# EAGLE design FilamentBox (EAGLE 7.4.0)
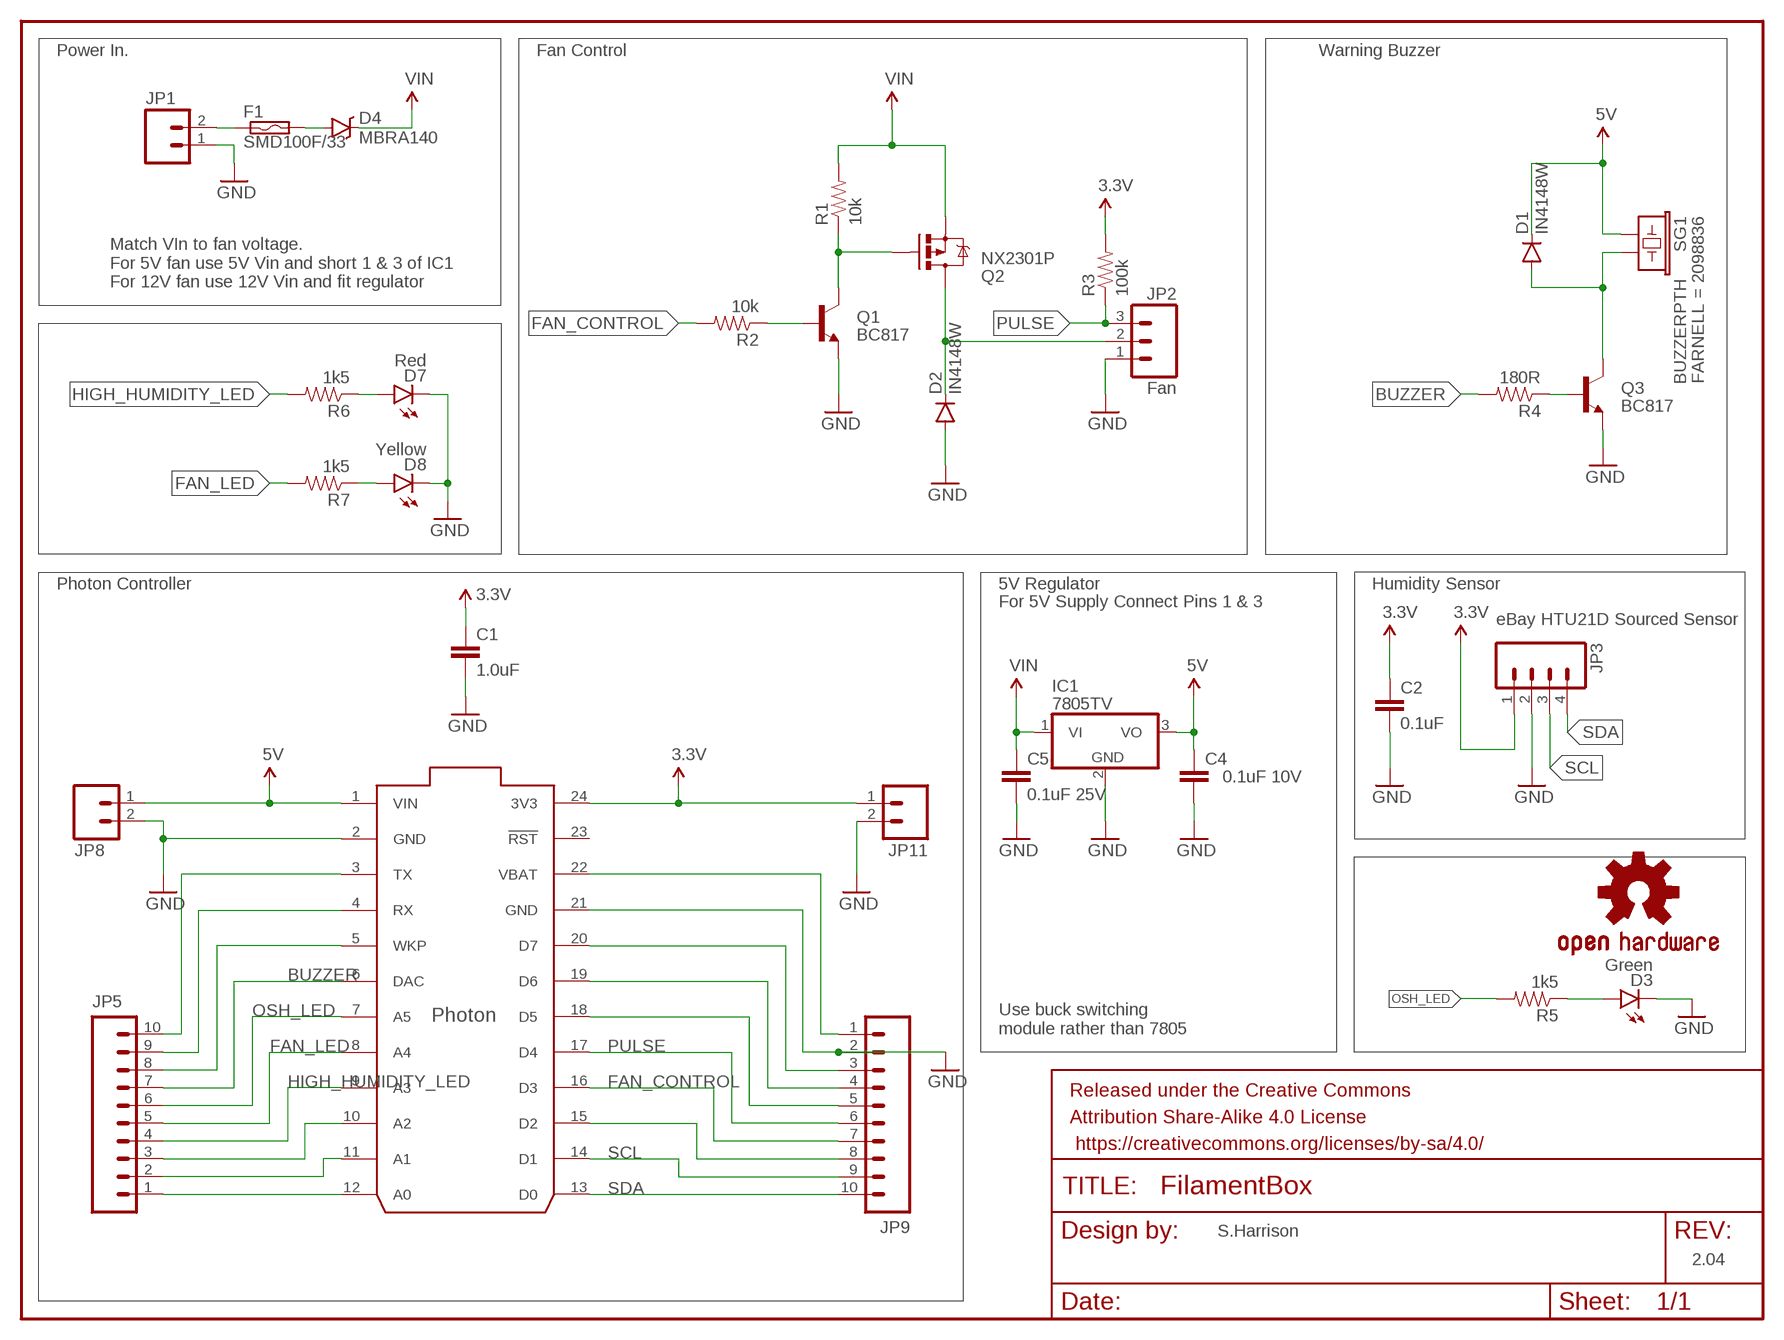
[diagram p0: schematic, sheet 1]

## Parts
C1  1.0uF  1.0UF-25V-+80/-20(0805)"  [0805-CAP]
C2  0.1uF  1.0UF-25V-+80/-20(0805)"  [0805-CAP]
C4  0.1uF 10V  1UF-25V-10%(0805)"  [0805-CAP]
C5  0.1uF 25V  1UF-25V-10%(0805)"  [0805-CAP]
D1  IN4148W  DIODESOD123  [SOD-123]
D2  IN4148W  DIODESOD123  [SOD-123]
D3  Green  LED1206-BOTTOM  [LED-1206-BOTTOM]
D4  MBRA140  DIODE-SCHOTTKY-MBRA140  [SMA-DIODE]
D7  Red  LED1206-BOTTOM  [LED-1206-BOTTOM]
D8  Yellow  LED1206-BOTTOM  [LED-1206-BOTTOM]
F1  SMD100F/33  [SMD050F]
FRAME1  FRAME-LETTER  [CREATIVE_COMMONS]
IC1  7805TV  [TO220V]
JP1  M02POLAR  [MOLEX-1X2]
JP2  Fan  M03POLAR  [MOLEX-1X3]
JP3  M04PTH  [1X04]
JP5  M10NO_SILK_PTH_FEMALE  [1X10_NO_SILK]
JP8  M021X02_NO_SILK  [1X02_NO_SILK]
JP9  M10NO_SILK_PTH_FEMALE  [1X10_NO_SILK]
JP11  M021X02_NO_SILK  [1X02_NO_SILK]
LOGO1  OSHW-LOGOL  [OSHW-LOGO-L]
Q1  BC817  BC817-40SMD  [SOT23-BEC]
Q2  NX2301P  MOSFET-PCHANNEL  [SOT23-3]
Q3  BC817  BC817-40SMD  [SOT23-BEC]
R1  10k  RESISTOR0805-RES  [0805]
R2  10k  RESISTOR0805-RES  [0805]
R3  100k  RESISTOR0805-RES  [0805]
R4  180R  RESISTOR0805-RES  [0805]
R5  1k5  RESISTOR0805-RES  [0805]
R6  1k5  RESISTOR0805-RES  [0805]
R7  1k5  RESISTOR0805-RES  [0805]
SG1  BUZZERPTH  [BUZZER-12MM]
U3  PHOTON  PHOTON_WITH_HEADERS  [PHOTON]

## Nets
3.3V: C1.1 C2.1 JP3.1 JP11.1 R3.2 U3.24(3V3)
5V: C4.1 D1.C IC1.3(VO) JP8.1 SG1.+ U3.1(VIN)
BUZZER: JP5.7 R4.2 U3.6(DAC)
FAN_CONTROL: JP9.7 R2.2 U3.16(D3)
FAN_LED: JP5.5 R7.2 U3.8(A4)
GND: C1.2 C2.2 C4.2 C5.2 D2.A D3.C D7.C D8.C IC1.2(GND) JP1.1 JP2.1 JP3.2 JP8.2 JP9.2 JP11.2 Q1.E Q3.E U3.2(GND) U3.21(GND)
HIGH_HUMIDITY_LED: JP5.4 R6.2 U3.9(A3)
N$1: JP5.1 U3.12(A0)
N$2: Q1.C Q2.1(G) R1.1
N$3: JP5.2 U3.11(A1)
N$4: Q1.B R2.1
N$5: JP5.3 U3.10(A2)
N$6: D2.C JP2.2 Q2.3(D)
N$10: JP9.8 U3.15(D2)
N$11: JP5.8 U3.5(WKP)
N$12: JP5.9 U3.4(RX)
N$13: JP5.10 U3.3(TX)
N$14: Q3.B R4.1
N$15: D1.A Q3.C SG1.-
N$16: JP9.3 U3.20(D7)
N$17: JP9.1 U3.22(VBAT)
N$18: D3.A R5.1
N$19: F1.1 JP1.2
N$20: D4.A F1.2
N$21: JP9.4 U3.19(D6)
N$22: JP9.5 U3.18(D5)
N$25: D7.A R6.1
N$26: D8.A R7.1
OSH_LED: JP5.6 R5.2 U3.7(A5)
PULSE: JP2.3 JP9.6 R3.1 U3.17(D4)
SCL: JP3.3 JP9.9 U3.14(D1)
SDA: JP3.4 JP9.10 U3.13(D0)
VIN: C5.1 D4.C IC1.1(VI) Q2.2(S) R1.2
Unconnected: U3.23(!RST)

## Notes on the sheet
- Power In. | Fan Control | Warning Buzzer
- Match VIn to fan voltage.
  For 5V fan use 5V Vin and short 1 & 3 of IC1
  For 12V fan use 12V Vin and fit regulator
- Photon Controller | 5V Regulator | Humidity Sensor
- For 5V Supply Connect Pins 1 & 3
- eBay HTU21D Sourced Sensor
- Use buck switching
  module rather than 7805
- S.Harrison
- 2.04

## Library data of the parts
C1 = SparkFun-Capacitors:1.0UF-25V-+80/-20(0805): CAP-11625; PROD_ID: CAP-11625
C2 = SparkFun-Capacitors:1.0UF-25V-+80/-20(0805): CAP-11625; PROD_ID: CAP-11625; VALUE: 1.0uF
C4 C5 = SparkFun-Capacitors:1UF-25V-10%(0805): CAP-08064
D1 D2 = SparkFun-DiscreteSemi:DIODE: Diode These are standard reverse protection diodes and small signal diodes. SMA package can handle up to about 1A. SOD-323 can handle about 200mA. What the SOD-323 package when ordering, there are some mfgs out there that are 5-pin packages.
D3 D7 D8 = SparkFun-LED:LED: LEDs Standard schematic elements and footprints for 5mm, 3mm, 1206, and 0603 sized LEDs. 5mm - Spark Fun Electronics SKU : COM-00529 (and others)
D4 = SparkFun-DiscreteSemi:DIODE-SCHOTTKY: Schottky diodes in SFE's production catalog BAT20J 1A 23V 0.62Vf RB751 120mA 40V 0.37Vf PMEG4005EJ 0.5A 40V 0.42Vf MBRA140 1A 40V 0.5Vf B340A 3A 40V SMA; PROD_ID: DIO-08053
F1 = switch-raychem:SMD*F: PolySwitch (TM) Resettable Device Source: Data sheet <http://www.farnell.com/datasheets/13482.pdf>; FARNELL: 1822224; MFG: LITTLEFUSE; MFGPART: 2920L075DR
FRAME1 = SparkFun-Aesthetics:FRAME-LETTER: Schematic Frame Standard 8.5x11 US Letter frame
IC1 = linear:78*: Positive VOLTAGE REGULATOR Source: http://cache.national.com/ds/LM/LM78L05.pdf http://www.fairchildsemi.com/ds/LM/LM7805.pdf
JP1 JP8 JP11 = SparkFun-Connectors:M02: Standard 2-pin 0.1" header. Use with - straight break away headers ( PRT-00116) - right angle break away headers (PRT-00553) - swiss pins (PRT-00743) - machine pins (PRT-00117) - female headers (PRT-00115) Molex polarized connector foot print use with: PRT-08233 with associated crimp pins and housings. 2.54_SCREWTERM for use with PRT-10571. 3.5mm Screw Terminal footprints for PRT-08084 5mm Screw Terminal footprints for use with PRT-08432
JP2 = SparkFun-Connectors:M03: Header 3 Standard 3-pin 0.1" header. Use with straight break away headers (SKU : PRT-00116), right angle break away headers (PRT-00553), swiss pins (PRT-00743), machine pins (PRT-00117), and female headers (PRT-00115). Molex polarized connector foot print use with SKU : PRT-08232 with associated crimp pins and housings.
JP3 = SparkFun-Connectors:M04: Header 4 Standard 4-pin 0.1" header. Use with straight break away headers (SKU : PRT-00116), right angle break away headers (PRT-00553), swiss pins (PRT-00743), machine pins (PRT-00117), and female headers (PRT-00115). Molex polarized connector foot print use with SKU : PRT-08231 with associated crimp pins and housings. 1MM SMD Version SKU: PRT-10208
JP5 JP9 = SparkFun-Connectors:M10: Header 10 Standard 10-pin 0.1" header. Use with straight break away headers (SKU : PRT-00116), right angle break away headers (PRT-00553), swiss pins (PRT-00743), machine pins (PRT-00117), and female headers (PRT-00115).; PROD_ID: CONN-11563
LOGO1 = Spark:OSHW-LOGO: Open Source Hardware Logo This logo indicates the piece of hardware it is found on incorporates a OSHW license and/or adheres to the definition of open source hardware found here: http://freedomdefined.org/OSHW
Q1 Q3 = transistor-npn:BC817*: NPN Transistor
Q2 = SparkFun-DiscreteSemi:MOSFET-PCHANNEL: Generic PMOSFET IRLML2244 - TRANS-11153 (SOT-23 -20V -4.3A) (1.Gate 2.Source 3.Drain) FQP27P06 - COM-10349 <http://www.sparkfun.com/products/10349> (TO-220 -60V -27A) (1.Gate 2.Source 3.Drain); PROD_ID: TRANS-08285
R1-R7 = SparkFun-Resistors:RESISTOR: Resistor Basic schematic elements and footprints for 0603, 1206, and PTH resistors.
SG1 = SparkFun-Electromechanical:BUZZER: Buzzer 12mm Spark Fun Electronics SKU : Comp-Buzzer; FARNELL: 2098836
U3 = Spark:PHOTON

## Board
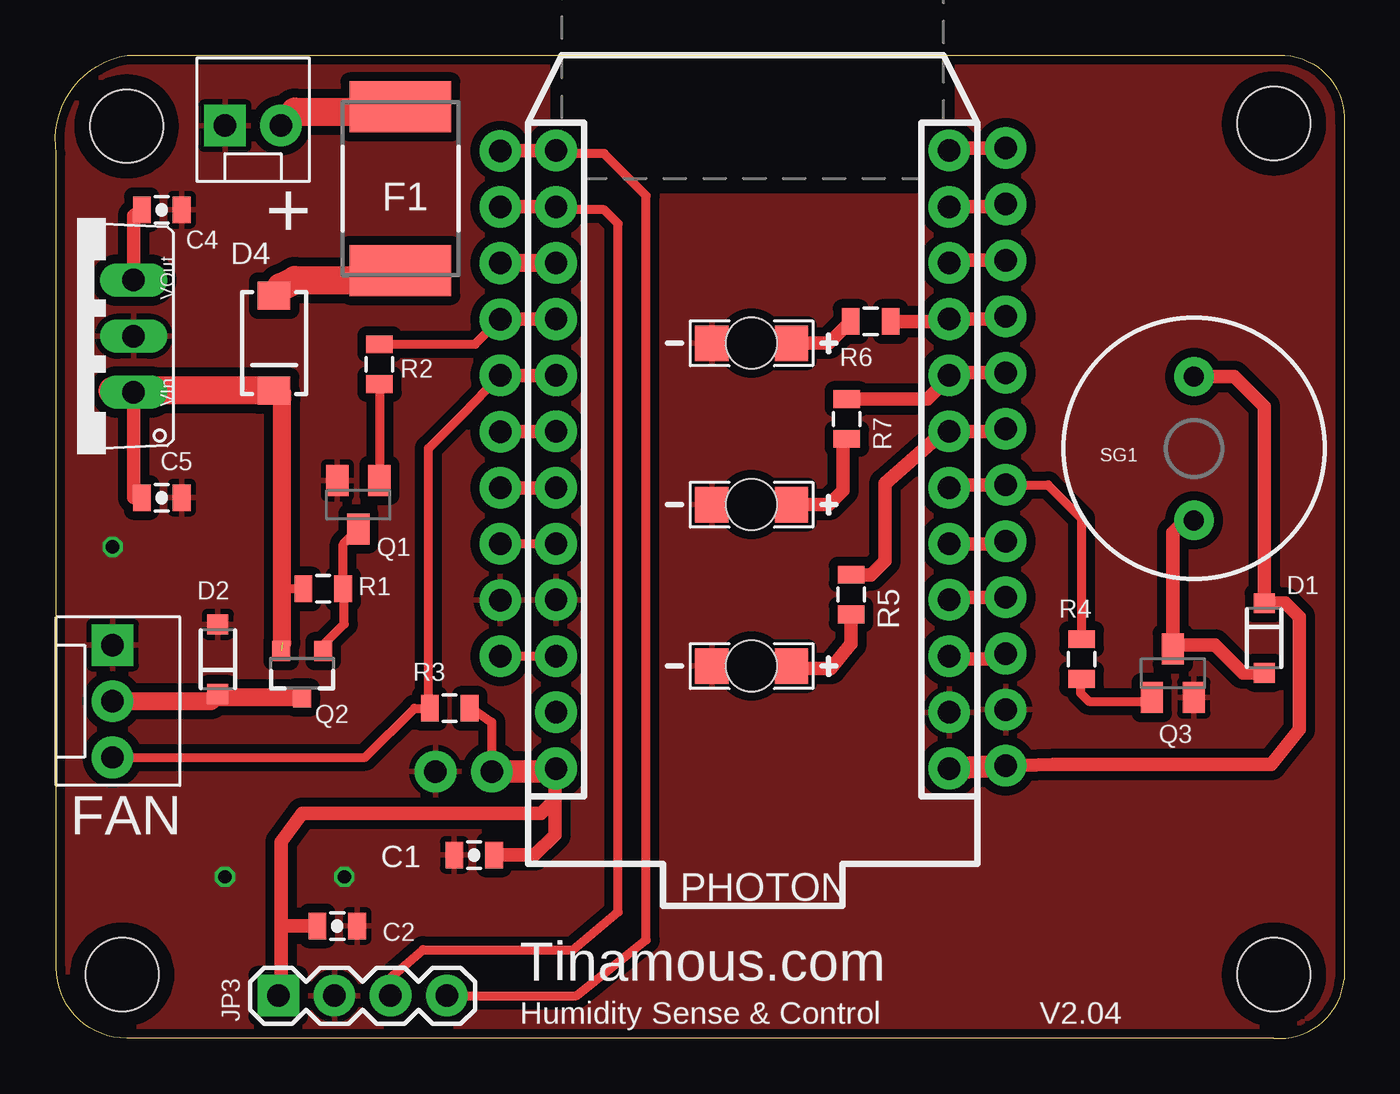
[diagram p1: board, top side]
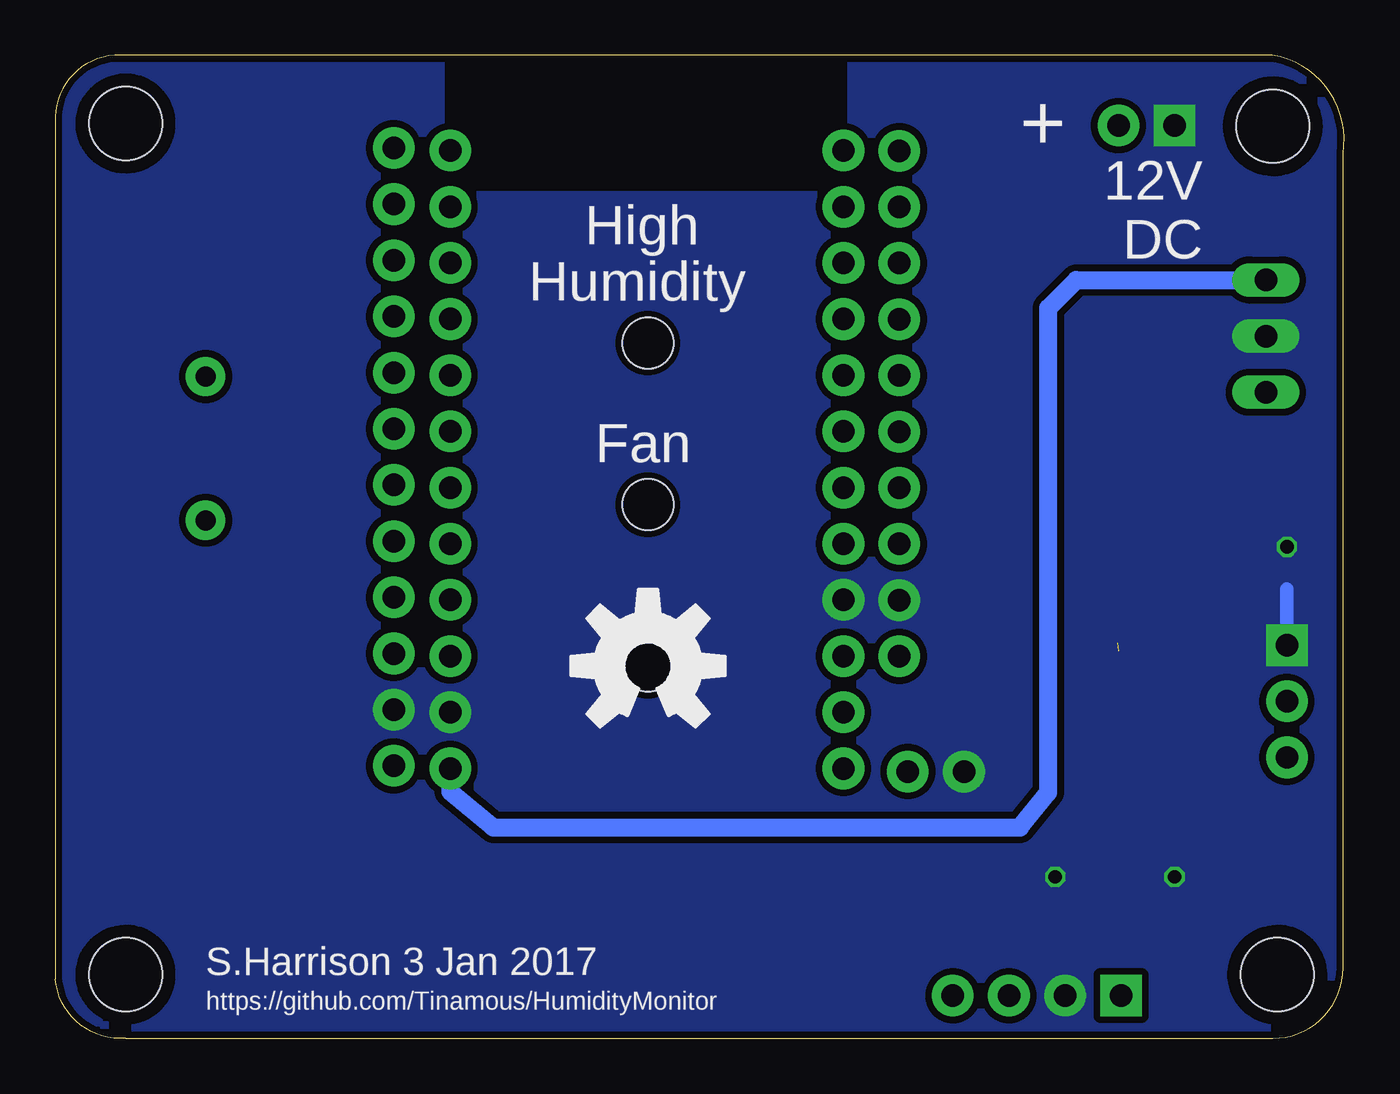
[diagram p2: board, bottom side, seen from below]

Size 58.28 x 44.46 mm. Coordinates in mm from the lower left corner, seen from the top.
Outline: 0.05,3.19 arc90 3.23,0.01 55.1,0.01 arc90 58.28,2.69 58.28,41.42 arc90 55.6,44.46 3.24,44.46 arc90 0.05,40.02 0.05,3.19
Outline: 0.05,3.12 0.05,3.19
Copper layers (1*16): Top 0.035mm / dielectric 1.5mm / Bottom 0.035mm
Design rules "dirt_cheap_dirty_boards.v1": minimum track width 5mil, minimum drill 12mil, track to track 5mil, track to pad 5mil, pad to pad 5mil, via to via 5mil, smd to smd 0mil, copper to edge 10mil, drill to drill 10mil, minimum pad ring 10mil, minimum via ring 6mil, stop-mask expansion 2mil, vias tented up to drill 25mil, thermal gap 10mil
tRestrict: area 22.9,38.7 to 40.1,48
bRestrict: area 22.9,38.7 to 40.2,48

### Footprints (pad centres in the part's own frame; a part is rotated, then mirrored left to right if it is on the bottom)
0805-CAP = smd 0.8 x 1.2: 1 -0.9,0; 2 0.9,0
SOD-123 = smd 0.9 x 0.95: A 1.575,0; C -1.575,0
LED-1206-BOTTOM = smd 1.5 x 1.6: A -1.8,0; C 1.8,0 | hole 2.3: 0,0
SMA-DIODE = smd 1.27 x 1.47: A -2.15,0; C 2.15,0
SMD050F = smd 2.3 x 4.6: 1 -3.7,0; 2 3.7,0
TO220V = drill 1.016 long: 1 -2.54,-2.54; 2 0,-2.54; 3 2.54,-2.54
MOLEX-1X2 = drill 1.016 pad 1.88 square: 1 0,0 | drill 1.016 pad 1.88: 2 2.54,0
MOLEX-1X3 = drill 1.016 pad 1.88 square: 1 0,0 | drill 1.016 pad 1.88: 2 2.54,0; 3 5.08,0
1X04 = drill 1.016 pad 1.88 square: 1 0,0 | drill 1.016 pad 1.88: 2 2.54,0; 3 5.08,0; 4 7.62,0
1X10_NO_SILK = drill 1.016 pad 1.88: 1 0,0; 2 2.54,0; 3 5.08,0; 4 7.62,0; 5 10.16,0; 6 12.7,0; 7 15.24,0; 8 17.78,0; 9 20.32,0; 10 22.86,0
1X02_NO_SILK = drill 1.016 pad 1.88: 1 0,0; 2 2.54,0
SOT23-BEC = smd 1 x 1.4: B -0.95,-1.1; C 0,1.1; E 0.95,-1.1
SOT23-3 = smd 0.8 x 0.9: 1 -0.95,-1; 2 0.95,-1; 3 0,1.1
0805 = smd 0.8 x 1.2: 1 -0.9,0; 2 0.9,0
BUZZER-12MM = drill 0.9 pad 1.778: + 3.25,0; - -3.25,0
PHOTON = drill 1.016 pad 1.88: 1 1.27,32.258; 2 1.27,29.718; 3 1.27,27.178; 4 1.27,24.638; 5 1.27,22.098; 6 1.27,19.558; 7 1.27,17.018; 8 1.27,14.478; 9 1.27,11.938; 10 1.27,9.398; 11 1.27,6.858; 12 1.27,4.318; 13 19.05,4.318; 14 19.05,6.858; 15 19.05,9.398; 16 19.05,11.938; 17 19.05,14.478; 18 19.05,17.018; 19 19.05,19.558; 20 19.05,22.098; 21 19.05,24.638; 22 19.05,27.178; 23 19.05,29.718; 24 19.05,32.258
STAND-OFF = hole 3.302: 0,0

### Placement (x,y rotation side)
C1  18.94,8.3 180 top
C2  12.75,5.09 0 top
C4  4.81,37.48 0 top
C5  4.81,24.46 0 top
D1  54.66,18.11 270 top
D2  7.35,17.16 90 top
D3  31.48,16.84 180 top
D4  9.89,31.44 270 top
D7  31.48,31.44 180 top
D8  31.48,24.14 180 top
F1  15.61,38.43 270 top
FRAME1  5.13,-10.15 0 top  (outside the outline)
IC1  1,31.76 90 top
JP1  7.67,41.29 0 top
JP2  2.59,17.79 270 top
JP3  10.08,1.94 0 top
JP5  42.98,40.27 270 top
JP8  42.98,12.33 90 top
JP9  20.12,17.28 90 top
JP11  19.74,12.08 180 top
LOGO1  31.48,16.84 0 bottom
Q1  13.7,24.14 180 top
Q2  11.16,16.52 180 top
Q3  50.53,16.52 0 top
R1  12.12,20.33 180 top
R2  14.66,30.49 90 top
R3  17.83,14.93 0 top
R4  46.41,17.16 90 top
R5  35.98,20.08 90 top
R6  36.87,32.42 0 top
R7  35.79,28.01 90 top
SG1  51.49,26.68 90 top
U3  41.69,44.47 180 top
U$1  [STAND-OFF]  3.03,2.89 0 top
U$2  [STAND-OFF]  55.1,2.89 0 top
U$3  [STAND-OFF]  55.1,41.38 0 top
U$4  [STAND-OFF]  3.23,41.25 0 top

### Tracks (layer width: path | path; a pad name or v marks a point on that pad's centre or on a via)
3.3V
  Top 0.406: 20.27,11.97 20.37,12.08 | R3.2 18.73,14.99 19.74,14.3 JP11.1
  Top 0.61: 10.21,5.09 10.21,8.9 11.16,10.17 21.96,10.17 22.59,10.81 | 10.21,5.09 10.21,2.06 JP3.1 | C2.1 10.21,5.09 | 19.84,11.97 JP11.1 | 22.59,10.81 22.59,12.16 U3.24 | C1.1 21.67,8.3 22.59,9.22 22.59,10.81
  Top 1.016: JP11.1 20.37,12.08 22.51,12.08 U3.24
5V
  Top 0.61: SG1.+ 53.32,29.93 54.66,28.59 D1.C 54.67,19.7 55.61,19.7 56.25,19.06 56.25,13.98 54.98,12.39 45.14,12.39 JP8.1 | IC1.3 3.54,37.21 C4.1 | 40.29,12.08 U3.1 40.24,12.39
  Top 1.016: JP8.1 42.72,12.33 U3.1
  Bottom 0.813: U3.1 40.42,11.17 38.47,9.54 14.66,9.54 13.39,11.12 13.39,33.03 12.12,34.3 IC1.3
BUZZER
  Top 0.406: JP5.7 44.88,25.03 46.41,23.51 R4.2
  Top 0.61: U3.6 40.54,25.03 JP5.7
FAN_CONTROL
  Top 0.406: R2.2 18.98,31.39 JP9.7
  Top 0.61: U3.16 22.63,32.52 JP9.7
FAN_LED
  Top 0.61: JP5.5 40.54,30.11 U3.8 40.29,29.86 40.37,29.86 39.43,28.91 R7.2
GND  (via drill 0.6)
  Bottom 0.61: 2.59,20.33 JP2.1
  other vias: 13.07,7.31 2.59,22.24 7.67,7.31
  pour Bottom (isolate 0.305, rank 6, no thermals): 58.47,44.46 58.47,2.55 56.57,0.01 2.59,0.01 0.05,2.55 0.05,42.56 2.59,44.46
  pour Top (isolate 0.406, rank 6): 58.47,44.46 58.47,32.4 58.47,0.01 0.05,0.01 0.05,44.46
HIGH_HUMIDITY_LED
  Top 0.61: JP5.4 42.86,32.53 U3.9 40.31,32.42 R6.2
N$1
  Top 0.61: U3.12 40.54,40.27 JP5.1
N$2
  Top 0.406: Q2.1 12.11,17.79 13.07,18.74 13.07,20.28 R1.1 13.02,22.35 Q1.C
N$3
  Top 0.61: JP5.2 42.86,37.61 U3.11
N$4
  Top 0.406: R2.1 Q1.B
N$5
  Top 0.61: U3.10 40.54,35.19 JP5.3
N$6
  Top 0.61: 7.2,15.42 D2.C 7.37,15.58
  Top 0.813: Q2.3 7.2,15.42 | 7.37,15.58 7.04,15.25 JP2.2
N$10
  Top 0.813: U3.15 JP9.8
N$11
  Top 0.61: JP5.8 42.86,22.37 U3.5
N$12
  Top 0.61: U3.4 40.54,19.95 JP5.9
N$13
  Top 0.61: JP5.10 42.72,17.16 40.69,17.16 40.55,17.29 U3.3
N$14
  Top 0.406: Q3.B 49.41,15.25 46.72,15.25 46.35,15.62 46.35,16.26 R4.1
N$15
  Top 0.61: SG1.- 51.09,23.43 50.53,22.87 Q3.C 50.7,17.79 52.44,17.79 53.7,16.53 D1.A
N$16
  Top 0.406: U3.20 22.63,22.36 JP9.3
N$17
  Top 0.406: JP9.1 U3.22
N$18
  Top 0.61: D3.A 33.39,16.73 35.08,16.73 35.93,17.79 35.98,17.84 R5.1
N$19
  Top 1.27: JP1.2 10.85,41.92 15.4,41.92 F1.1
N$20
  Top 1.27: D4.A 10.21,33.98 10.85,34.3 15.18,34.3 F1.2
N$21
  Top 0.61: JP9.4 22.63,24.9 U3.19
N$22
  Top 0.61: JP9.5 22.63,27.44 U3.18
N$25
  Top 0.61: R6.1 35.95,32.42 34.98,31.44 D7.A
N$26
  Top 0.61: D8.A 34.98,24.14 35.61,24.78 35.61,26.94 R7.1
OSH_LED
  Top 0.61: JP5.6 42.86,27.45 U3.7 40.19,27.45 37.52,25.09 37.52,21.6 36.88,20.97 36.31,20.97 R5.2
PULSE
  Top 0.406: JP2.3 14.02,12.71 16.24,14.93 R3.1 16.88,14.99 16.88,26.68 18.47,28.27 19.99,29.86 JP9.6
  Top 0.61: U3.17 22.63,29.98 JP9.6
SCL
  Top 0.406: JP3.3 15.16,2.74 15.29,2.87 16.62,4.01 23.42,4.01 25.45,5.73 25.45,36.84 24.82,37.48 22.78,37.48
  Top 0.61: 22.78,37.48 U3.14 JP9.9
SDA
  Top 0.406: JP3.4 23.57,1.94 26.72,4.46 26.72,38.11 24.82,40.02 22.78,40.02
  Top 0.61: 22.78,40.02 U3.13 JP9.10
VIN  (1 unrouted)
  Top 0.406: R1.2 10.26,20.33
  Top 0.61: C5.1 3.54,24.46 IC1.1
  Top 0.813: 10.26,29.17 10.21,29.22 8.38,29.22 D4.C 10.26,28.92 10.26,20.33 10.26,17.89
  Top 1.27: D4.C 2.59,29.29 IC1.1

### Text on the board
tPlace: VOut | VIn
tNames: + | FAN | Tinamous.com | Humidity Sense & Control | V2.04
bNames: + | 12V / DC | High | Humidity | Fan | S.Harrison 3 Jan 2017 | https://github.com/Tinamous/HumidityMonitor